# EAGLE schematic CustomKeyboard (EAGLE 8.3.1)
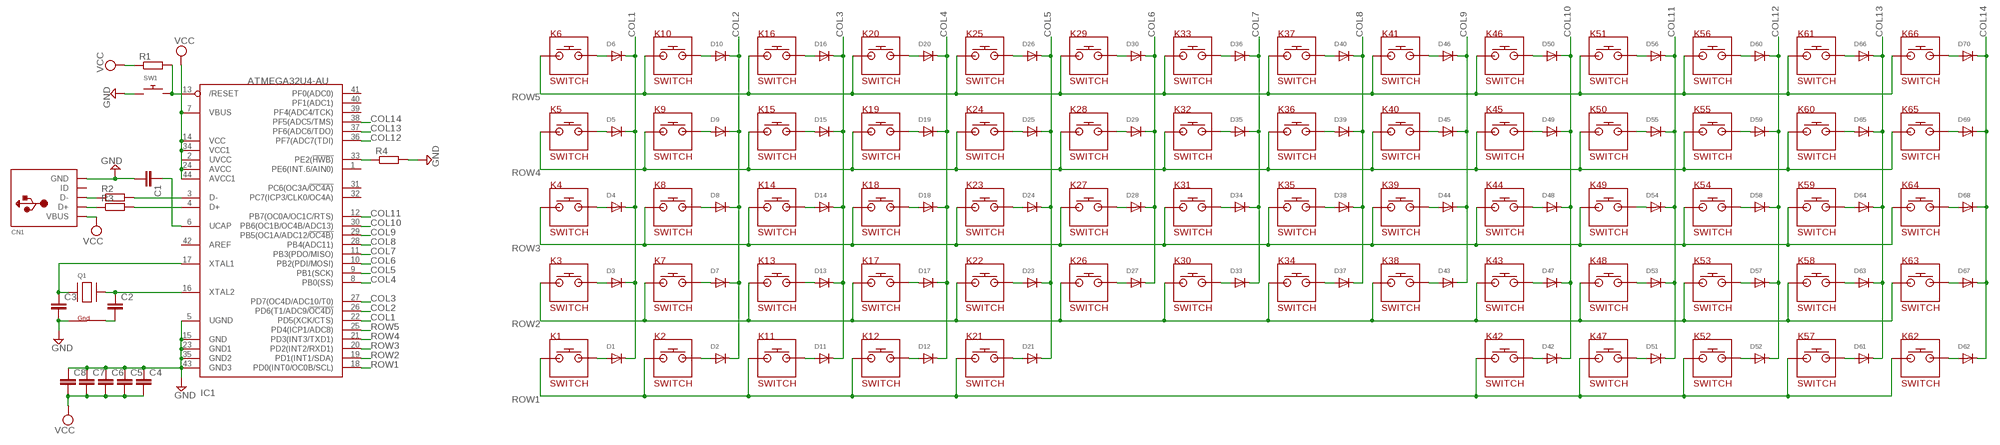
[diagram p0: schematic, sheet 1]

## Parts
C1  C  [C0805]
C2  C  [C0805]
C3  C  [C0805]
C4  C  [C0805]
C5  C  [C0805]
C6  C  [C0805]
C7  C  [C0805]
C8  C  [C0805]
CN1  USBMINIB  [USB-MINIB]
D1  DIODESMA  [SMADIODE]
D2  DIODESMA  [SMADIODE]
D3  DIODESMA  [SMADIODE]
D4  DIODESMA  [SMADIODE]
D5  DIODESMA  [SMADIODE]
D6  DIODESMA  [SMADIODE]
D7  DIODESMA  [SMADIODE]
D8  DIODESMA  [SMADIODE]
D9  DIODESMA  [SMADIODE]
D10  DIODESMA  [SMADIODE]
D11  DIODESMA  [SMADIODE]
D12  DIODESMA  [SMADIODE]
D13  DIODESMA  [SMADIODE]
D14  DIODESMA  [SMADIODE]
D15  DIODESMA  [SMADIODE]
D16  DIODESMA  [SMADIODE]
D17  DIODESMA  [SMADIODE]
D18  DIODESMA  [SMADIODE]
D19  DIODESMA  [SMADIODE]
D20  DIODESMA  [SMADIODE]
D21  DIODESMA  [SMADIODE]
D23  DIODESMA  [SMADIODE]
D24  DIODESMA  [SMADIODE]
D25  DIODESMA  [SMADIODE]
D26  DIODESMA  [SMADIODE]
D27  DIODESMA  [SMADIODE]
D28  DIODESMA  [SMADIODE]
D29  DIODESMA  [SMADIODE]
D30  DIODESMA  [SMADIODE]
D33  DIODESMA  [SMADIODE]
D34  DIODESMA  [SMADIODE]
D35  DIODESMA  [SMADIODE]
D36  DIODESMA  [SMADIODE]
D37  DIODESMA  [SMADIODE]
D38  DIODESMA  [SMADIODE]
D39  DIODESMA  [SMADIODE]
D40  DIODESMA  [SMADIODE]
D42  DIODESMA  [SMADIODE]
D43  DIODESMA  [SMADIODE]
D44  DIODESMA  [SMADIODE]
D45  DIODESMA  [SMADIODE]
D46  DIODESMA  [SMADIODE]
D47  DIODESMA  [SMADIODE]
D48  DIODESMA  [SMADIODE]
D49  DIODESMA  [SMADIODE]
D50  DIODESMA  [SMADIODE]
D51  DIODESMA  [SMADIODE]
D52  DIODESMA  [SMADIODE]
D53  DIODESMA  [SMADIODE]
D54  DIODESMA  [SMADIODE]
D55  DIODESMA  [SMADIODE]
D56  DIODESMA  [SMADIODE]
D57  DIODESMA  [SMADIODE]
D58  DIODESMA  [SMADIODE]
D59  DIODESMA  [SMADIODE]
D60  DIODESMA  [SMADIODE]
D61  DIODESMA  [SMADIODE]
D62  DIODESMA  [SMADIODE]
D63  DIODESMA  [SMADIODE]
D64  DIODESMA  [SMADIODE]
D65  DIODESMA  [SMADIODE]
D66  DIODESMA  [SMADIODE]
D67  DIODESMA  [SMADIODE]
D68  DIODESMA  [SMADIODE]
D69  DIODESMA  [SMADIODE]
D70  DIODESMA  [SMADIODE]
IC1  ATMEGA32U4-AU  [TQFP44]
K1  SWITCH  [KAILH_LOW_PROFILE]
K2  SWITCH  [KAILH_LOW_PROFILE]
K3  SWITCH  [KAILH_LOW_PROFILE]
K4  SWITCH  [KAILH_LOW_PROFILE]
K5  SWITCH  [KAILH_LOW_PROFILE]
K6  SWITCH  [KAILH_LOW_PROFILE]
K7  SWITCH  [KAILH_LOW_PROFILE]
K8  SWITCH  [KAILH_LOW_PROFILE]
K9  SWITCH  [KAILH_LOW_PROFILE]
K10  SWITCH  [KAILH_LOW_PROFILE]
K11  SWITCH  [KAILH_LOW_PROFILE]
K12  SWITCH  [KAILH_LOW_PROFILE]
K13  SWITCH  [KAILH_LOW_PROFILE]
K14  SWITCH  [KAILH_LOW_PROFILE]
K15  SWITCH  [KAILH_LOW_PROFILE]
K16  SWITCH  [KAILH_LOW_PROFILE]
K17  SWITCH  [KAILH_LOW_PROFILE]
K18  SWITCH  [KAILH_LOW_PROFILE]
K19  SWITCH  [KAILH_LOW_PROFILE]
K20  SWITCH  [KAILH_LOW_PROFILE]
K21  SWITCH  [KAILH_LOW_PROFILE]
K22  SWITCH  [KAILH_LOW_PROFILE]
K23  SWITCH  [KAILH_LOW_PROFILE]
K24  SWITCH  [KAILH_LOW_PROFILE]
K25  SWITCH  [KAILH_LOW_PROFILE]
K26  SWITCH  [KAILH_LOW_PROFILE]
K27  SWITCH  [KAILH_LOW_PROFILE]
K28  SWITCH  [KAILH_LOW_PROFILE]
K29  SWITCH  [KAILH_LOW_PROFILE]
K30  SWITCH  [KAILH_LOW_PROFILE]
K31  SWITCH  [KAILH_LOW_PROFILE]
K32  SWITCH  [KAILH_LOW_PROFILE]
K33  SWITCH  [KAILH_LOW_PROFILE]
K34  SWITCH  [KAILH_LOW_PROFILE]
K35  SWITCH  [KAILH_LOW_PROFILE]
K36  SWITCH  [KAILH_LOW_PROFILE]
K37  SWITCH  [KAILH_LOW_PROFILE]
K38  SWITCH  [KAILH_LOW_PROFILE]
K39  SWITCH  [KAILH_LOW_PROFILE]
K40  SWITCH  [KAILH_LOW_PROFILE]
K41  SWITCH  [KAILH_LOW_PROFILE]
K42  SWITCH  [KAILH_LOW_PROFILE]
K43  SWITCH  [KAILH_LOW_PROFILE]
K44  SWITCH  [KAILH_LOW_PROFILE]
K45  SWITCH  [KAILH_LOW_PROFILE]
K46  SWITCH  [KAILH_LOW_PROFILE]
K47  SWITCH  [KAILH_LOW_PROFILE]
K48  SWITCH  [KAILH_LOW_PROFILE]
K49  SWITCH  [KAILH_LOW_PROFILE]
K50  SWITCH  [KAILH_LOW_PROFILE]
K51  SWITCH  [KAILH_LOW_PROFILE]
K52  SWITCH  [KAILH_LOW_PROFILE]
K53  SWITCH  [KAILH_LOW_PROFILE]
K54  SWITCH  [KAILH_LOW_PROFILE]
K55  SWITCH  [KAILH_LOW_PROFILE]
K56  SWITCH  [KAILH_LOW_PROFILE]
K57  SWITCH  [KAILH_LOW_PROFILE]
K58  SWITCH  [KAILH_LOW_PROFILE]
K59  SWITCH  [KAILH_LOW_PROFILE]
K60  SWITCH  [KAILH_LOW_PROFILE]
K61  SWITCH  [KAILH_LOW_PROFILE]
K62  SWITCH  [KAILH_LOW_PROFILE]
K63  SWITCH  [KAILH_LOW_PROFILE]
K64  SWITCH  [KAILH_LOW_PROFILE]
K65  SWITCH  [KAILH_LOW_PROFILE]
K66  SWITCH  [KAILH_LOW_PROFILE]
Q1  XTAL-4-3225  [NX3225]
R1  R  [R0805]
R2  R  [R0805]
R3  R  [R0805]
R4  R  [R0805]
SW1  SWITCH_PUSHBUTTONSOFTTOUCHSMD_SJ  [PUSHBUTTON_SMD_SJ]

## Nets
COL1: D1.C D3.C D4.C D5.C D6.C IC1.22(PD5(XCK/CTS))
COL2: D2.C D7.C D8.C D9.C D10.C IC1.26(PD6(T1/ADC9/!OC4D))
COL3: D11.C D13.C D14.C D15.C D16.C IC1.27(PD7(OC4D/ADC10/T0))
COL4: D12.C D17.C D18.C D19.C D20.C IC1.8(PB0(SS))
COL5: D21.C D23.C D24.C D25.C D26.C IC1.9(PB1(SCK))
COL6: D27.C D28.C D29.C D30.C IC1.10(PB2(PDI/MOSI))
COL7: D33.C D34.C D35.C D36.C IC1.11(PB3(PDO/MISO))
COL8: D37.C D38.C D39.C D40.C IC1.28(PB4(ADC11))
COL9: D43.C D44.C D45.C D46.C IC1.29(PB5(OC1A/ADC12/!OC4B))
COL10: D42.C D47.C D48.C D49.C D50.C IC1.30(PB6(OC1B/OC4B/ADC13))
COL11: D51.C D53.C D54.C D55.C D56.C IC1.12(PB7(OC0A/OC1C/RTS))
COL12: D52.C D57.C D58.C D59.C D60.C IC1.36(PF7(ADC7(TDI))
COL13: D61.C D63.C D64.C D65.C D66.C IC1.37(PF6(ADC6/TDO))
COL14: D62.C D67.C D68.C D69.C D70.C IC1.38(PF5(ADC5/TMS))
GND: C1.2 C3.2 C4.1 C5.1 C6.1 C7.1 C8.1 CN1.GND IC1.5(UGND) IC1.15(GND) IC1.23(GND1) IC1.35(GND2) IC1.43(GND3) Q1.4(G1) R4.2 SW1.P$1
N$1: IC1.13(/RESET) R1.2 SW1.P$2
N$2: CN1.D- R2.1
N$3: CN1.D+ R3.1
N$4: IC1.3(D-) R2.2
N$5: IC1.4(D+) R3.2
N$6: C1.1 IC1.6(UCAP)
N$7: C2.1 IC1.16(XTAL2) Q1.3(X2)
N$8: C2.2 Q1.2(G2)
N$9: C3.1 IC1.17(XTAL1) Q1.1(X1)
N$10: IC1.33(PE2(!HWB)) R4.1
N$30: D6.A K6.P$2
N$31: D10.A K10.P$2
N$32: D16.A K16.P$2
N$33: D20.A K20.P$2
N$34: D26.A K25.P$2
N$35: D30.A K29.P$2
N$36: D36.A K33.P$2
N$37: D40.A K37.P$2
N$38: D46.A K41.P$2
N$39: D50.A K46.P$2
N$40: D56.A K51.P$2
N$41: D60.A K56.P$2
N$42: D66.A K61.P$2
N$43: D70.A K66.P$2
N$44: D69.A K65.P$2
N$45: D65.A K60.P$2
N$46: D59.A K55.P$2
N$47: D55.A K50.P$2
N$48: D49.A K45.P$2
N$49: D45.A K40.P$2
N$50: D39.A K36.P$2
N$51: D35.A K32.P$2
N$52: D29.A K28.P$2
N$53: D25.A K24.P$2
N$54: D19.A K19.P$2
N$55: D15.A K15.P$2
N$56: D9.A K9.P$2
N$57: D5.A K5.P$2
N$58: D4.A K4.P$2
N$59: D8.A K8.P$2
N$60: D14.A K14.P$2
N$61: D18.A K18.P$2
N$62: D17.A K17.P$2
N$63: D13.A K13.P$2
N$64: D7.A K7.P$2
N$65: D3.A K3.P$2
N$66: D1.A K1.P$2
N$67: D2.A K2.P$2
N$68: D11.A K11.P$2
N$69: D12.A K12.P$2
N$70: D21.A K21.P$2
N$71: D23.A K22.P$2
N$72: D24.A K23.P$2
N$73: D28.A K27.P$2
N$74: D27.A K26.P$2
N$75: D34.A K31.P$2
N$76: D33.A K30.P$2
N$77: D38.A K35.P$2
N$78: D37.A K34.P$2
N$79: D44.A K39.P$2
N$80: D43.A K38.P$2
N$81: D42.A K42.P$2
N$82: D47.A K43.P$2
N$83: D48.A K44.P$2
N$84: D54.A K49.P$2
N$85: D53.A K48.P$2
N$86: D51.A K47.P$2
N$87: D58.A K54.P$2
N$88: D57.A K53.P$2
N$89: D52.A K52.P$2
N$90: D64.A K59.P$2
N$91: D63.A K58.P$2
N$92: D61.A K57.P$2
N$93: D68.A K64.P$2
N$94: D67.A K63.P$2
N$95: D62.A K62.P$2
ROW1: IC1.18(PD0(INT0/OC0B/SCL)) K1.P$1 K2.P$1 K11.P$1 K12.P$1 K21.P$1 K42.P$1 K47.P$1 K52.P$1 K57.P$1 K62.P$1
ROW2: IC1.19(PD1(INT1/SDA)) K3.P$1 K7.P$1 K13.P$1 K17.P$1 K22.P$1 K26.P$1 K30.P$1 K34.P$1 K38.P$1 K43.P$1 K48.P$1 K53.P$1 K58.P$1 K63.P$1
ROW3: IC1.20(PD2(INT2/RXD1)) K4.P$1 K8.P$1 K14.P$1 K18.P$1 K23.P$1 K27.P$1 K31.P$1 K35.P$1 K39.P$1 K44.P$1 K49.P$1 K54.P$1 K59.P$1 K64.P$1
ROW4: IC1.21(PD3(INT3/TXD1)) K5.P$1 K9.P$1 K15.P$1 K19.P$1 K24.P$1 K28.P$1 K32.P$1 K36.P$1 K40.P$1 K45.P$1 K50.P$1 K55.P$1 K60.P$1 K65.P$1
ROW5: IC1.25(PD4(ICP1/ADC8)) K6.P$1 K10.P$1 K16.P$1 K20.P$1 K25.P$1 K29.P$1 K33.P$1 K37.P$1 K41.P$1 K46.P$1 K51.P$1 K56.P$1 K61.P$1 K66.P$1
VCC: C4.2 C5.2 C6.2 C7.2 C8.2 CN1.VBUS IC1.7(VBUS) IC1.14(VCC) IC1.24(AVCC) IC1.34(VCC1) IC1.44(AVCC1) R1.1
Unconnected: CN1.ID IC1.1(PE6(INT.6/AIN0)) IC1.2(UVCC) IC1.31(PC6(OC3A/!OC4A)) IC1.32(PC7(ICP3/CLK0/OC4A)) IC1.39(PF4(ADC4/TCK)) IC1.40(PF1(ADC1)) IC1.41(PF0(ADC0)) IC1.42(AREF)

## Library data of the parts
C1-C8 = eagle-ltspice:C: CAPACITOR, European symbol; SPICEMODEL: NONE; SPICEPREFIX: C
CN1 = adafruit:USB: USB Connectors USBMINIB - Surface Mount Female Mini-B USB Connector 4UConnector: 06564 By microbuilder.eu Thru-hole RA Female Mini-B USB Connector 4UConnector: 18732 By ladyada.net
D1-D21 D23-D30 D33-D40 D42-D70 = adafruit:DIODE: Diode SMADIODE - SMA Surface Mount Package 20V 1A Schottky Diode Digikey: 641-1014-6-ND DO-1N4148 - Through Hole Small Current Diode SOD-123 20V 1 A (.5mV Vf) Schottky Diode - Digikey: MBRX120TPMSCT-ND SOD-323 10V 570mA (.38mV Vf, 3ns) Schottky Diode - Digikey: ZLLS410CT-ND SOD-523 30V 30mA Schottky Diode (RB751S-40TE61) - Digikey: RB751S-40TE61CT-ND SOT23-R/W - SOT23 Package (R = Solder Paste/Reflow Ovens, W = Hand-Soldering) BAT54Film 40V 300mA - Digikey: 497-7162-1-ND
IC1 = adafruit:ATMEGA32U4: http://www.ladyada.net/library/eagle
K1-K66 = keyboard_switch:SWITCH
Q1 = adafruit:XTAL-4: Classic 4-pin 3.2 x 2.5mm crystal
R1-R4 = eagle-ltspice:R: RESISTOR, European symbol; SPICEMODEL: NONE; SPICEPREFIX: R
SW1 = adafruit:SWITCH_PUSHBUTTON: Buttons SOFTTOUCHSMD_SJ - Soft touch temporary push button (Super Junk Akihabara) Compatible with SKPMANE010 [Mouser: 688-SKPMAN] C&K_KSS = Digikey: KSS221GLFS